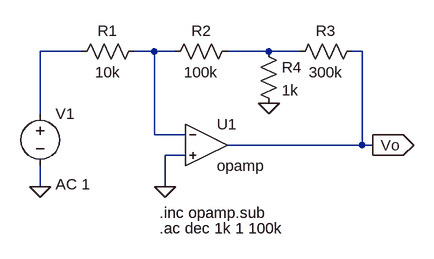
[diagram p0: schematic EJE1_B.asc]
EJE1_B.asc, the LTspice schematic file:
Version 4
SHEET 1 880 680
WIRE 32 80 -32 80
WIRE 144 80 112 80
WIRE 176 80 144 80
WIRE 320 80 256 80
WIRE 368 80 320 80
WIRE 464 80 448 80
WIRE -32 176 -32 80
WIRE 144 208 144 80
WIRE 192 208 144 208
WIRE 464 224 464 80
WIRE 464 224 256 224
WIRE 480 224 464 224
WIRE 192 240 160 240
WIRE -32 288 -32 256
WIRE 160 288 160 240
FLAG 160 288 0
FLAG -32 288 0
FLAG 480 224 Vo
IOPIN 480 224 Out
FLAG 320 160 0
SYMBOL res 128 64 R90
WINDOW 0 0 56 VBottom 2
WINDOW 3 32 56 VTop 2
SYMATTR InstName R1
SYMATTR Value 10k
SYMBOL res 272 64 R90
WINDOW 0 0 56 VBottom 2
WINDOW 3 32 56 VTop 2
SYMATTR InstName R2
SYMATTR Value 100k
SYMBOL OpAmps\\opamp 224 160 R0
SYMATTR InstName U1
SYMATTR SpiceLine2 GBW=100Meg
SYMBOL voltage -32 160 R0
WINDOW 123 24 124 Left 2
WINDOW 39 0 0 Left 0
SYMATTR InstName V1
SYMATTR Value ""
SYMATTR Value2 AC 1
SYMBOL res 304 64 R0
SYMATTR InstName R4
SYMATTR Value 1k
SYMBOL res 464 64 R90
WINDOW 0 0 56 VBottom 2
WINDOW 3 32 56 VTop 2
SYMATTR InstName R3
SYMATTR Value 300k
TEXT 152 328 Left 2 !.inc opamp.sub
TEXT 152 352 Left 2 !.ac dec 1k 1 100k

The netlist it stands for:
* EJE1_B.asc
R1 N002 N001 10k
R2 N003 N002 100k
XU1 N002 0 Vo opamp Aol=100K GBW=100Meg  ; pins invin noninvin out
V1 N001 0 AC 1
R4 N003 0 1k
R3 Vo N003 300k
.inc opamp.sub
.ac dec 1k 1 100k
.backanno
.end